# EAGLE schematic Motion Controller Electronics Diagram v3 (EAGLE 9.7.0)
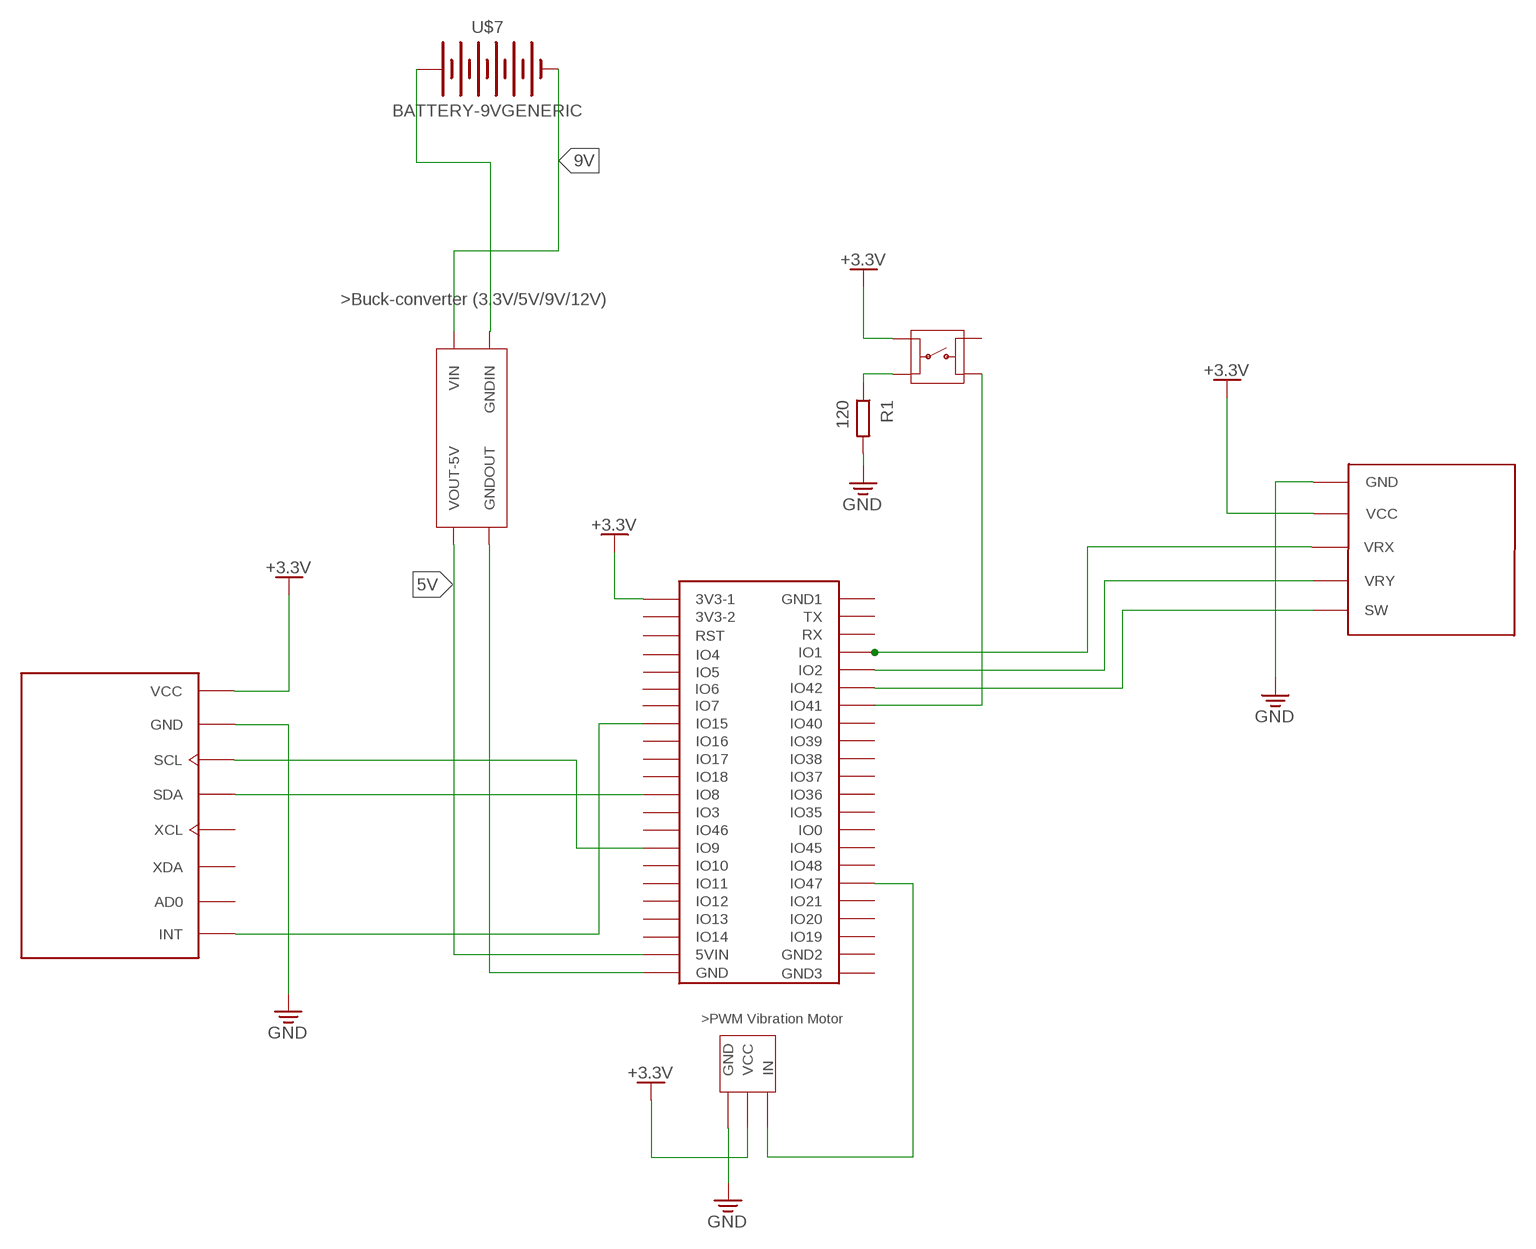
[diagram p0: schematic, sheet 1]

## Parts
R1  120  R  (no package)
U$1  JOYSTICK  (no package)
U$2  DC-DC_BUCK-CONVERTER  (no package)
U$3  PWM-VIBRATION-MOTOR  (no package)
U$4  TACTILE-SWITCH  (no package)
U$5  ESP32-S3-DEVKITC-1  (no package)
U$6  MPU6050  (no package)
U$7  BATTERY-9VGENERIC  [BATTERY-GENERIC]

## Nets
5V: U$2.VOUT-5V U$5.5VIN
9V: U$2.VIN U$7.-
+3.3V: U$1.VCC U$3.VCC U$4.1 U$5.3V3-1 U$6.VCC
GND: R1.2 U$1.GND U$3.GND U$6.GND
N$1: U$2.GNDOUT U$5.GND
N$2: U$5.IO15 U$6.INT
N$3: U$2.GNDIN U$7.+
N$4: U$5.IO9 U$6.SCL
N$5: U$3.IN U$5.IO47
N$6: U$1.VRX U$5.IO1
N$7: U$1.VRY U$5.IO2
N$8: U$1.SW U$5.IO42
N$9: R1.1 U$4.2
N$10: U$4.4 U$5.IO41
N$11: U$5.IO8 U$6.SDA
Unconnected: U$4.3 U$5.3V3-2 U$5.GND1 U$5.GND2 U$5.GND3 U$5.IO0 U$5.IO3 U$5.IO4 U$5.IO5 U$5.IO6 U$5.IO7 U$5.IO10 U$5.IO11 U$5.IO12 U$5.IO13 U$5.IO14 U$5.IO16 U$5.IO17 U$5.IO18 U$5.IO19 U$5.IO20 U$5.IO21 U$5.IO35 U$5.IO36 U$5.IO37 U$5.IO38 U$5.IO39 U$5.IO40 U$5.IO45 U$5.IO46 U$5.IO48 U$5.RST U$5.RX U$5.TX U$6.AD0 U$6.XCL U$6.XDA

## Library data of the parts
R1 = ngspice-simulation:R: RESISTOR
U$1 = Motion Controller Component Library:JOYSTICK
U$2 = Motion Controller Component Library:DC-DC_BUCK-CONVERTER
U$3 = Motion Controller Component Library:PWM-VIBRATION-MOTOR
U$4 = Motion Controller Component Library:TACTILE-SWITCH
U$5 = Motion Controller Component Library:ESP32-S3-DEVKITC-1
U$6 = Motion Controller Component Library:MPU6050
U$7 = Tinkercad:BATTERY-9V